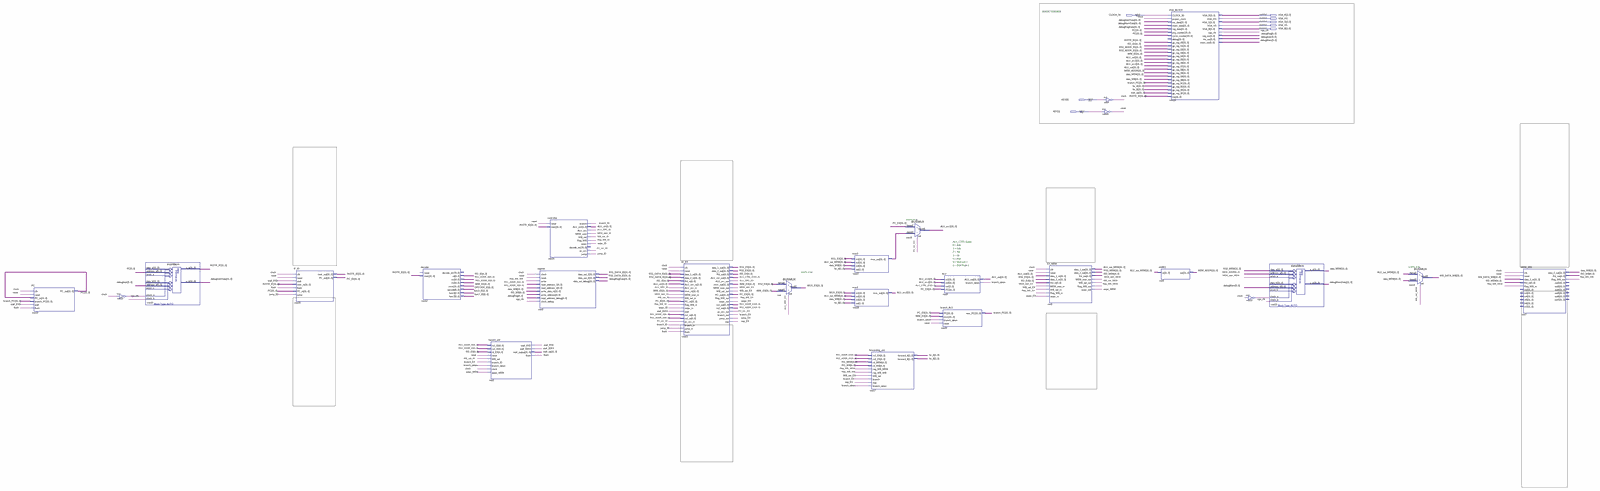
[diagram p0: schematic sheet, whole]
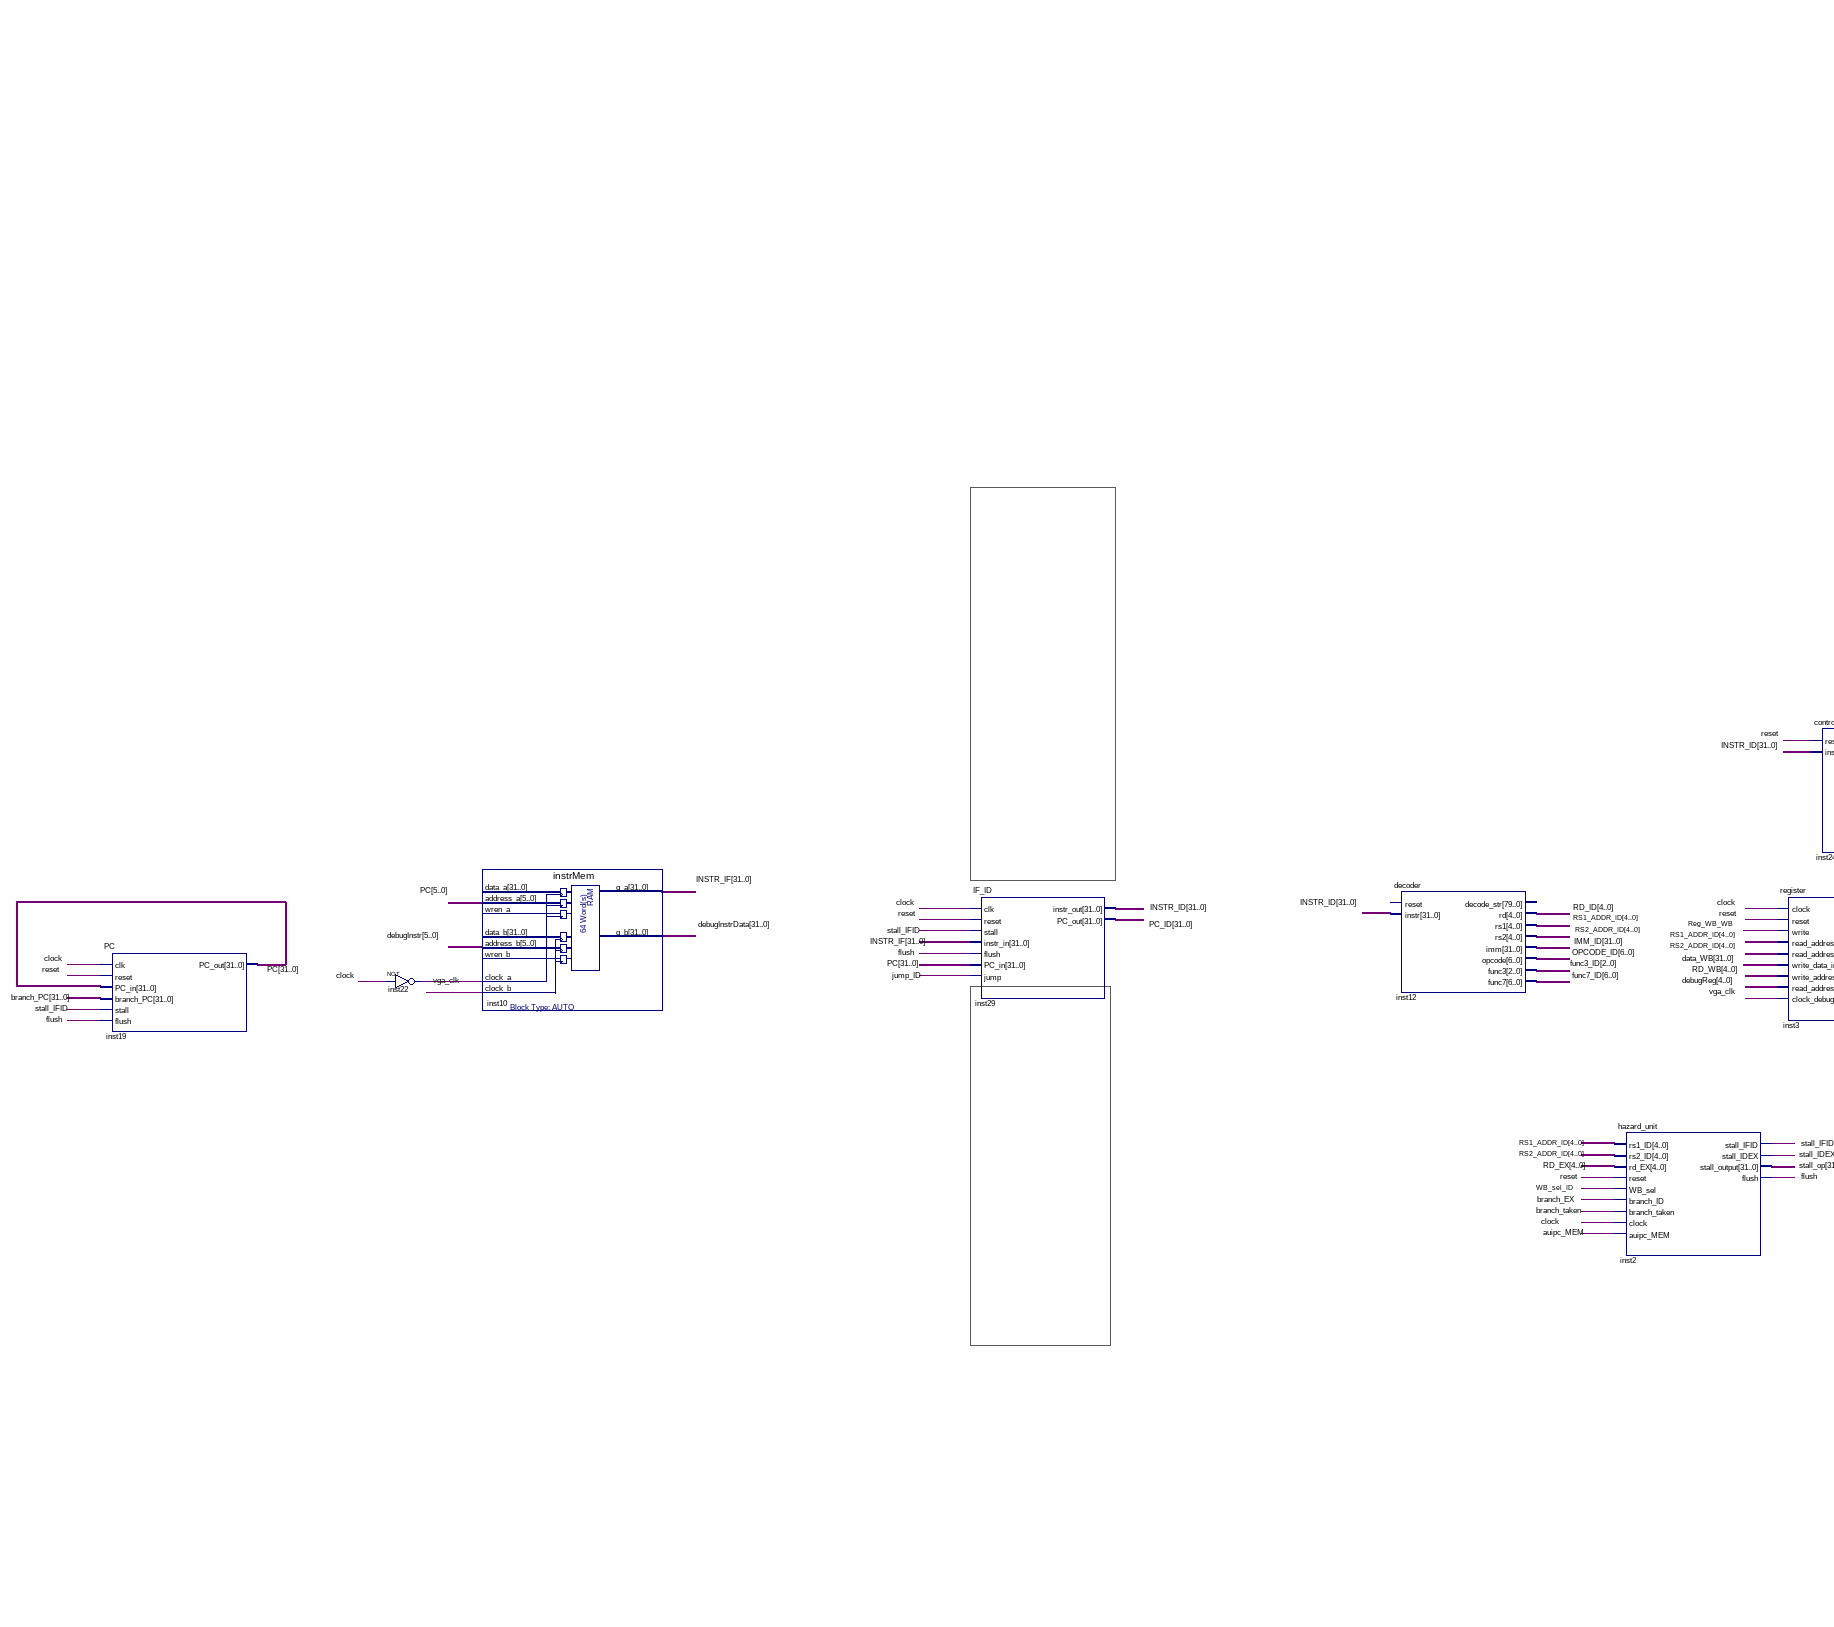
[diagram p1: schematic sheet, left part]
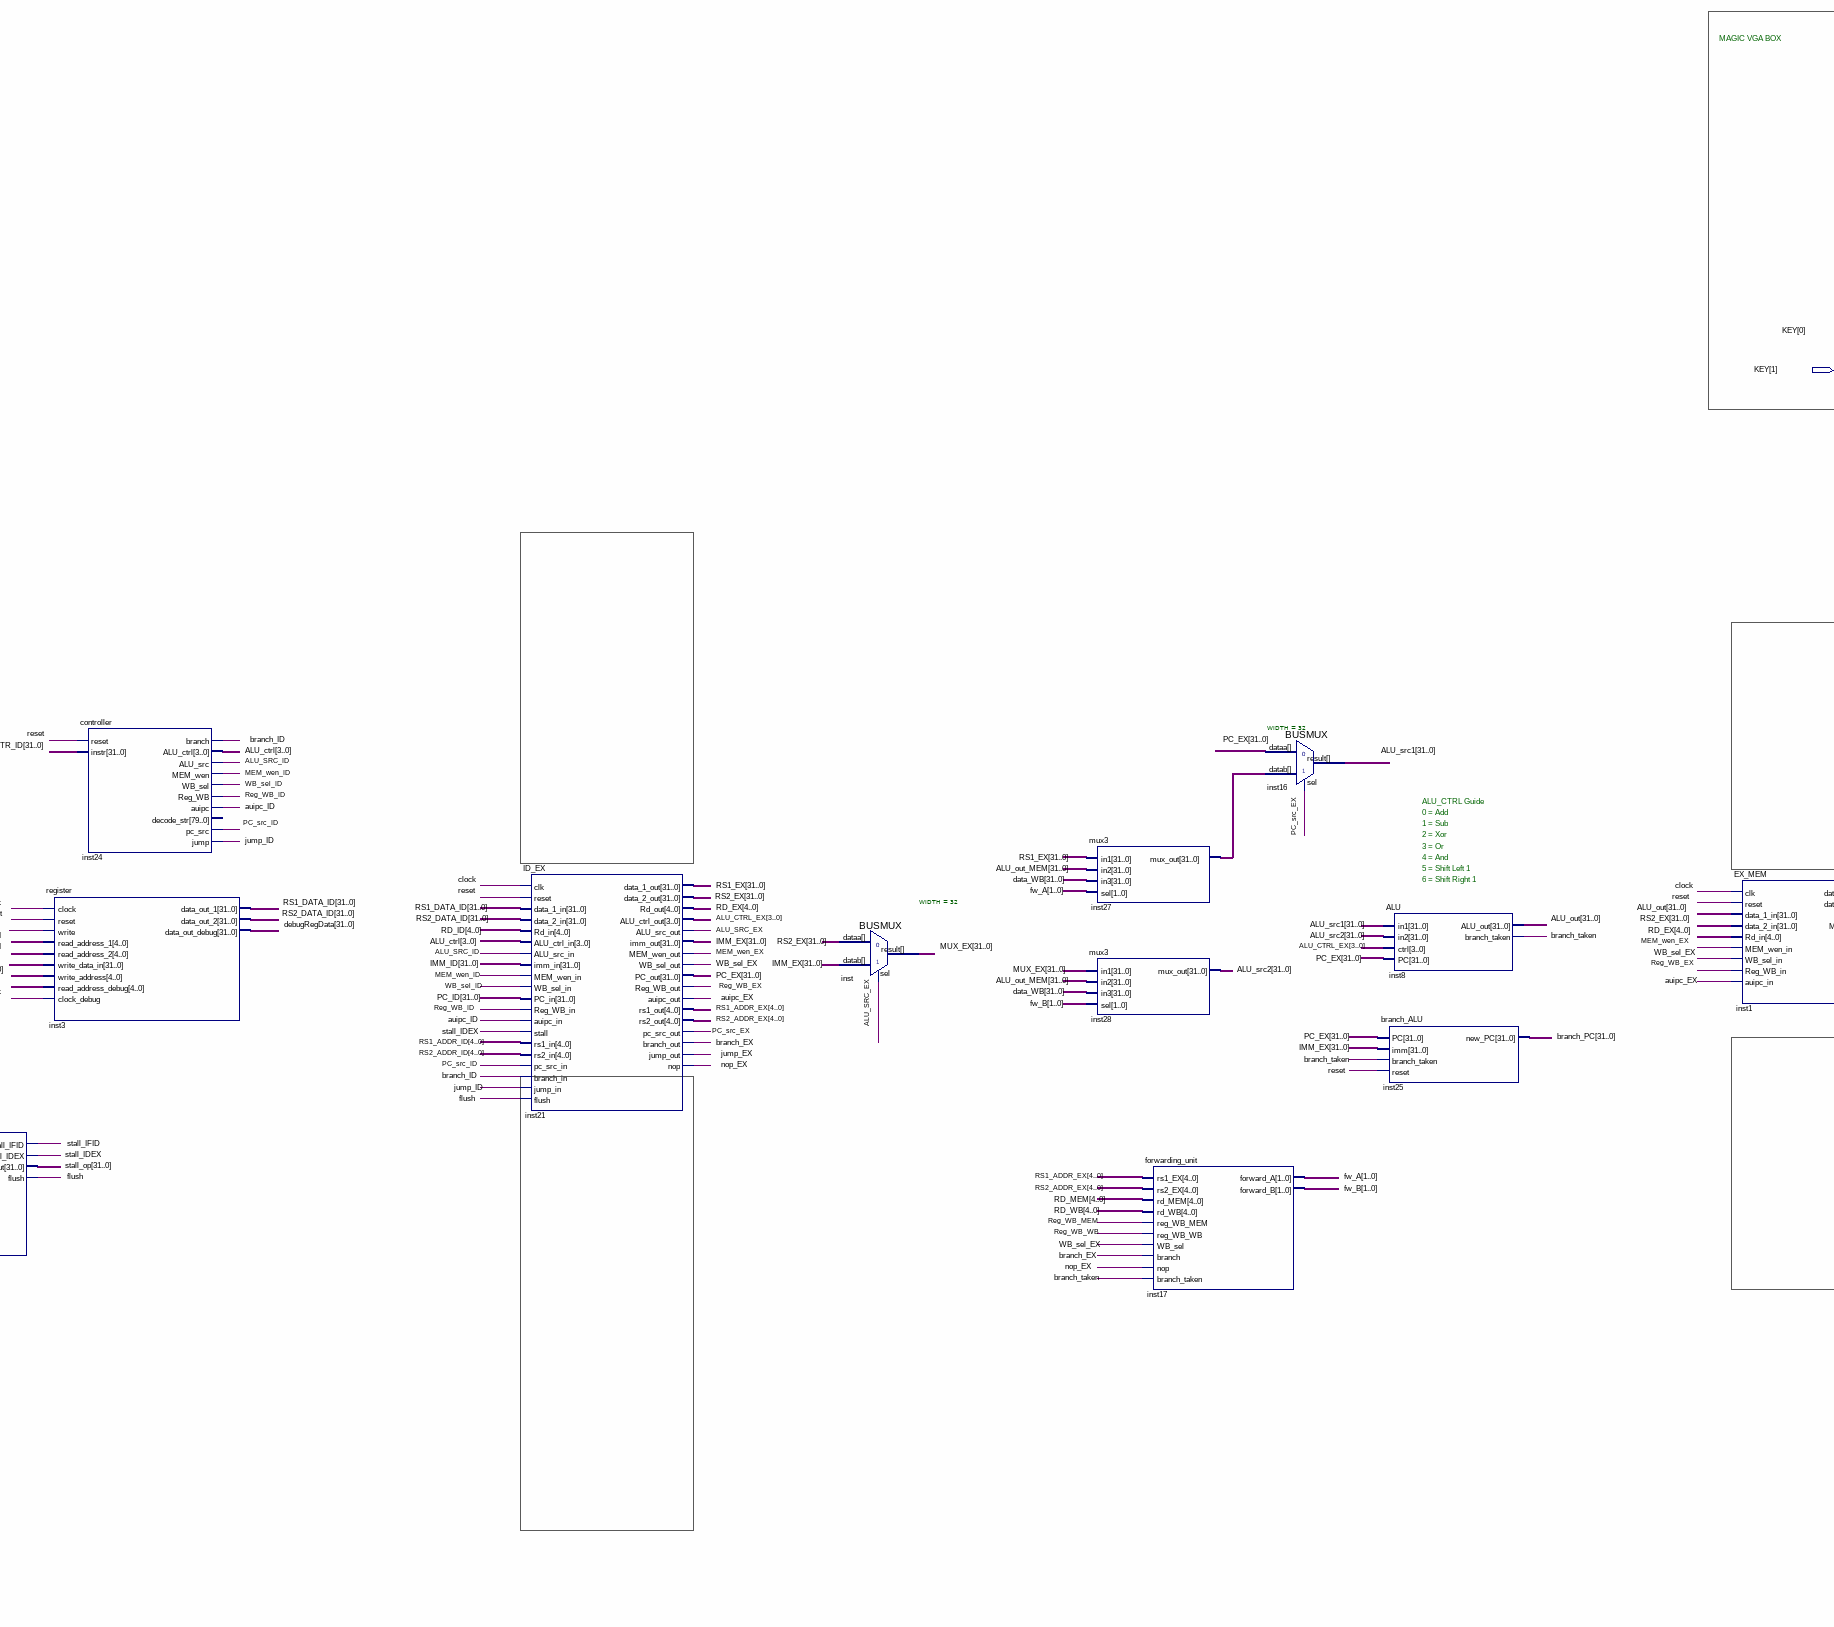
[diagram p2: schematic sheet, centre part]
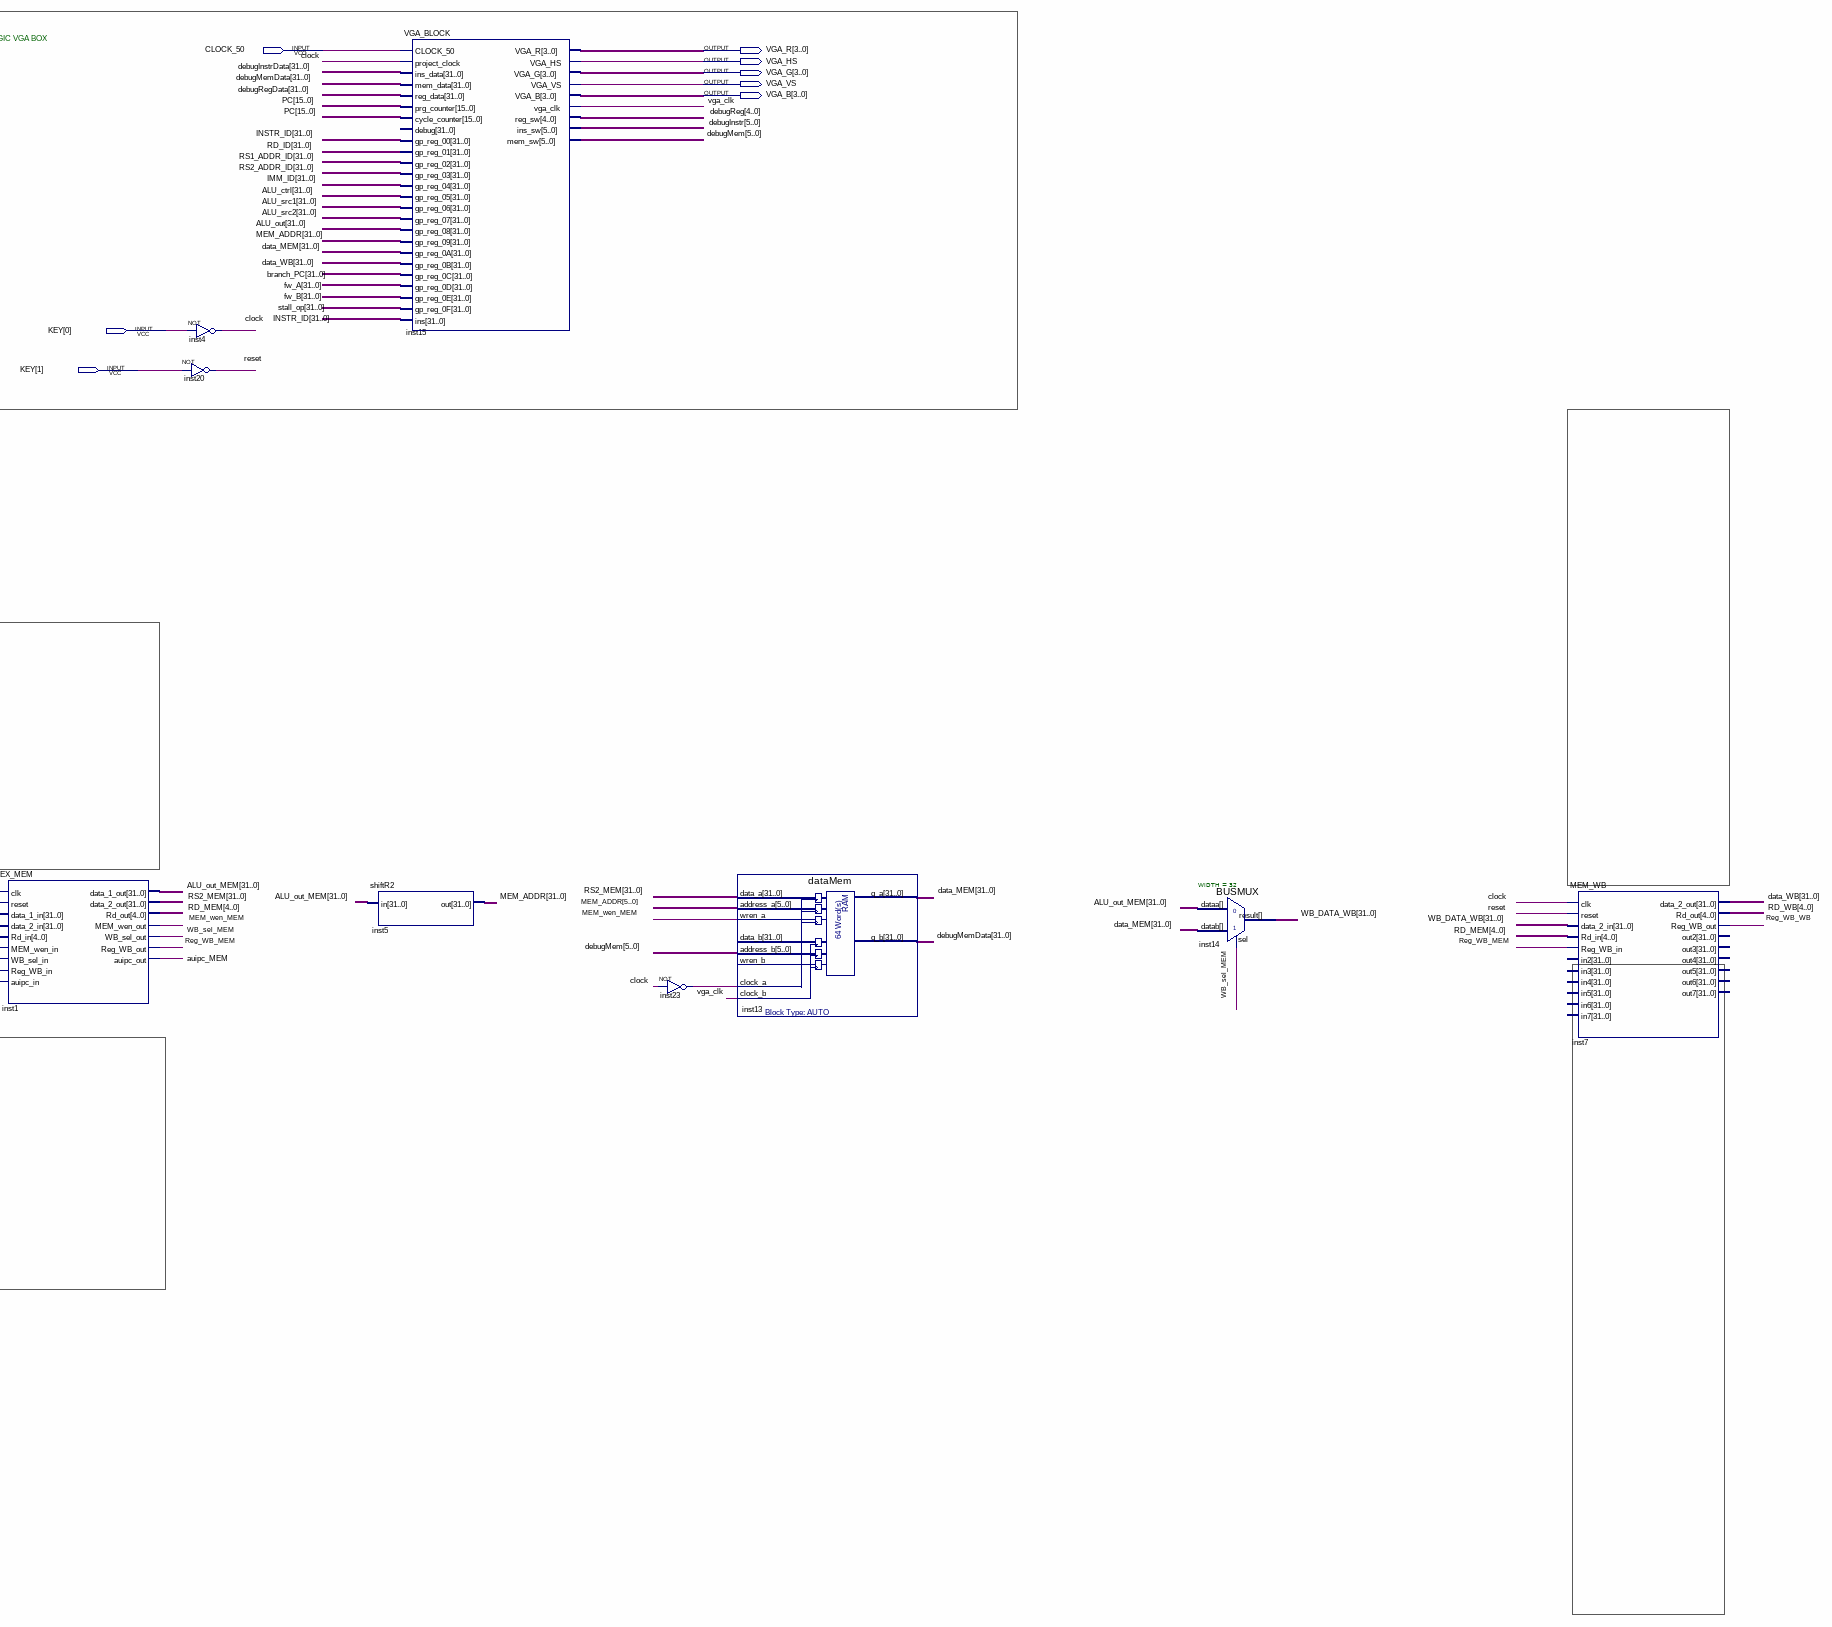
[diagram p3: schematic sheet, right part]
// Quartus schematic top.bdf as structural Verilog: 25 symbols, 8 pins
module top (
  input  CLOCK_50,
  input  [1:0] KEY,
  output [3:0] VGA_R,
  output VGA_HS,
  output [3:0] VGA_G,
  output VGA_VS,
  output [3:0] VGA_B
);

  wire ALU_SRC_EX, ALU_SRC_ID, auipc_EX, auipc_ID, auipc_MEM, branch_EX, branch_ID, branch_taken, clock,
       flush, inst22_out, inst23_out, jump_EX, jump_ID, MEM_wen_EX, MEM_wen_ID, MEM_wen_MEM, nop_EX,
       PC_src_EX, PC_src_ID, Reg_WB_EX, Reg_WB_ID, Reg_WB_MEM, Reg_WB_WB, reset, stall_IDEX, stall_IFID,
       vga_clk, WB_sel_EX, WB_sel_ID, WB_sel_MEM;
  wire [2:0] func3_ID;
  wire [3:0] ALU_CTRL_EX;
  wire [4:0] debugReg, RD_EX, RD_MEM, RD_WB, RS1_ADDR_EX, RS2_ADDR_EX;
  wire [5:0] debugInstr, debugMem;
  wire [6:0] func7_ID, OPCODE_ID;
  wire [31:0] ALU_ctrl, ALU_out, ALU_out_MEM, ALU_src1, ALU_src2, branch_PC, data_MEM, data_WB,
       debugInstrData, debugMemData, debugRegData, fw_A, fw_B, IMM_EX, IMM_ID, inst27_mux_out, INSTR_ID,
       INSTR_IF, MEM_ADDR, MUX_EX, PC, PC_EX, PC_ID, RD_ID, RS1_ADDR_ID, RS1_DATA_ID, RS1_EX, RS2_ADDR_ID,
       RS2_DATA_ID, RS2_EX, RS2_MEM, stall_op, WB_DATA_WB;

  PC inst19 (
    .clk(clock), .reset(reset), .PC_in(PC), .branch_PC(branch_PC), .stall(stall_IFID), .flush(flush),
    .PC_out(PC));
  not inst22 (inst22_out, clock);
  instrMem inst10 (
    .address_a(PC[5:0]), .address_b(debugInstr), .clock_a(inst22_out), .clock_b(vga_clk), .q_a(INSTR_IF),
    .q_b(debugInstrData));  // open: data_a, wren_a, data_b, wren_b
  IF_ID inst29 (
    .clk(clock), .reset(reset), .stall(stall_IFID), .instr_in(INSTR_IF), .flush(flush), .PC_in(PC),
    .jump(jump_ID), .instr_out(INSTR_ID), .PC_out(PC_ID));
  decoder inst12 (
    .instr(INSTR_ID), .rd(RD_ID[4:0]), .rs1(RS1_ADDR_ID[4:0]), .rs2(RS2_ADDR_ID[4:0]), .imm(IMM_ID),
    .opcode(OPCODE_ID), .func3(func3_ID), .func7(func7_ID));  // open: reset, decode_str
  hazard_unit inst2 (
    .rs1_ID(RS1_ADDR_ID[4:0]), .rs2_ID(RS2_ADDR_ID[4:0]), .rd_EX(RD_EX), .reset(reset), .WB_sel(WB_sel_ID),
    .branch_ID(branch_EX), .branch_taken(branch_taken), .clock(clock), .auipc_MEM(auipc_MEM),
    .stall_IFID(stall_IFID), .stall_IDEX(stall_IDEX), .stall_output(stall_op), .flush(flush));
  controller inst24 (
    .reset(reset), .instr(INSTR_ID), .branch(branch_ID), .ALU_ctrl(ALU_ctrl[3:0]), .ALU_src(ALU_SRC_ID),
    .MEM_wen(MEM_wen_ID), .WB_sel(WB_sel_ID), .Reg_WB(Reg_WB_ID), .auipc(auipc_ID), .pc_src(PC_src_ID),
    .jump(jump_ID));  // open: decode_str
  register inst3 (
    .clock(clock), .reset(reset), .write(Reg_WB_WB), .read_address_1(RS1_ADDR_ID[4:0]),
    .read_address_2(RS2_ADDR_ID[4:0]), .write_data_in(data_WB), .write_address(RD_WB),
    .read_address_debug(debugReg), .clock_debug(vga_clk), .data_out_1(RS1_DATA_ID), .data_out_2(RS2_DATA_ID),
    .data_out_debug(debugRegData));
  ID_EX inst21 (
    .clk(clock), .reset(reset), .data_1_in(RS1_DATA_ID), .data_2_in(RS2_DATA_ID), .Rd_in(RD_ID[4:0]),
    .ALU_ctrl_in(ALU_ctrl[3:0]), .ALU_src_in(ALU_SRC_ID), .imm_in(IMM_ID), .MEM_wen_in(MEM_wen_ID),
    .WB_sel_in(WB_sel_ID), .PC_in(PC_ID), .Reg_WB_in(Reg_WB_ID), .auipc_in(auipc_ID), .stall(stall_IDEX),
    .rs1_in(RS1_ADDR_ID[4:0]), .rs2_in(RS2_ADDR_ID[4:0]), .pc_src_in(PC_src_ID), .branch_in(branch_ID),
    .jump_in(jump_ID), .flush(flush), .data_1_out(RS1_EX), .data_2_out(RS2_EX), .Rd_out(RD_EX),
    .ALU_ctrl_out(ALU_CTRL_EX), .ALU_src_out(ALU_SRC_EX), .imm_out(IMM_EX), .MEM_wen_out(MEM_wen_EX),
    .WB_sel_out(WB_sel_EX), .PC_out(PC_EX), .Reg_WB_out(Reg_WB_EX), .auipc_out(auipc_EX),
    .rs1_out(RS1_ADDR_EX), .rs2_out(RS2_ADDR_EX), .pc_src_out(PC_src_EX), .branch_out(branch_EX),
    .jump_out(jump_EX), .nop(nop_EX));
  BUSMUX #(.WIDTH(32)) inst (.datab(IMM_EX), .sel(ALU_SRC_EX), .dataa(RS2_EX), .result(MUX_EX));
  mux3 inst27 (.in1(RS1_EX), .in2(ALU_out_MEM), .in3(data_WB), .sel(fw_A[1:0]), .mux_out(inst27_mux_out));
  mux3 inst28 (.in1(MUX_EX), .in2(ALU_out_MEM), .in3(data_WB), .sel(fw_B[1:0]), .mux_out(ALU_src2));
  forwarding_unit inst17 (
    .rs1_EX(RS1_ADDR_EX), .rs2_EX(RS2_ADDR_EX), .rd_MEM(RD_MEM), .rd_WB(RD_WB), .reg_WB_MEM(Reg_WB_MEM),
    .reg_WB_WB(Reg_WB_WB), .WB_sel(WB_sel_EX), .branch(branch_EX), .nop(nop_EX), .branch_taken(branch_taken),
    .forward_A(fw_A[1:0]), .forward_B(fw_B[1:0]));
  BUSMUX #(.WIDTH(32)) inst16 (.datab(inst27_mux_out), .sel(PC_src_EX), .dataa(PC_EX), .result(ALU_src1));
  ALU inst8 (
    .in1(ALU_src1), .in2(ALU_src2), .ctrl(ALU_CTRL_EX), .PC(PC_EX), .ALU_out(ALU_out),
    .branch_taken(branch_taken));
  branch_ALU inst25 (.PC(PC_EX), .imm(IMM_EX), .branch_taken(branch_taken), .reset(reset), .new_PC(branch_PC));
  EX_MEM inst1 (
    .clk(clock), .reset(reset), .data_1_in(ALU_out), .data_2_in(RS2_EX), .Rd_in(RD_EX),
    .MEM_wen_in(MEM_wen_EX), .WB_sel_in(WB_sel_EX), .Reg_WB_in(Reg_WB_EX), .auipc_in(auipc_EX),
    .data_1_out(ALU_out_MEM), .data_2_out(RS2_MEM), .Rd_out(RD_MEM), .MEM_wen_out(MEM_wen_MEM),
    .WB_sel_out(WB_sel_MEM), .Reg_WB_out(Reg_WB_MEM), .auipc_out(auipc_MEM));
  not inst4 (clock, KEY[0]);
  not inst20 (reset, KEY[1]);
  shiftR2 inst5 (.in(ALU_out_MEM), .out(MEM_ADDR));
  VGA_BLOCK inst15 (
    .CLOCK_50(CLOCK_50), .project_clock(clock), .ins_data(debugInstrData), .mem_data(debugMemData),
    .reg_data(debugRegData), .prg_counter(PC[15:0]), .cycle_counter(PC[15:0]), .gp_reg_00(INSTR_ID),
    .gp_reg_01(RD_ID), .gp_reg_02(RS1_ADDR_ID), .gp_reg_03(RS2_ADDR_ID), .gp_reg_04(IMM_ID),
    .gp_reg_05(ALU_ctrl), .gp_reg_06(ALU_src1), .gp_reg_07(ALU_src2), .gp_reg_08(ALU_out),
    .gp_reg_09(MEM_ADDR), .gp_reg_0A(data_MEM), .gp_reg_0B(data_WB), .gp_reg_0C(branch_PC), .gp_reg_0D(fw_A),
    .gp_reg_0E(fw_B), .gp_reg_0F(stall_op), .ins(INSTR_ID), .VGA_R(VGA_R), .VGA_HS(VGA_HS), .VGA_G(VGA_G),
    .VGA_VS(VGA_VS), .VGA_B(VGA_B), .vga_clk(vga_clk), .reg_sw(debugReg), .ins_sw(debugInstr),
    .mem_sw(debugMem));  // open: debug
  not inst23 (inst23_out, clock);
  dataMem inst13 (
    .data_a(RS2_MEM), .address_a(MEM_ADDR[5:0]), .wren_a(MEM_wen_MEM), .address_b(debugMem),
    .clock_a(inst23_out), .clock_b(vga_clk), .q_a(data_MEM), .q_b(debugMemData));  // open: data_b, wren_b
  BUSMUX #(.WIDTH(32)) inst14 (.datab(data_MEM), .sel(WB_sel_MEM), .dataa(ALU_out_MEM), .result(WB_DATA_WB));
  MEM_WB inst7 (
    .clk(clock), .reset(reset), .data_2_in(WB_DATA_WB), .Rd_in(RD_MEM), .Reg_WB_in(Reg_WB_MEM),
    .data_2_out(data_WB), .Rd_out(RD_WB), .Reg_WB_out(Reg_WB_WB));  // open: in2, in3, in4, in5, in6, in7, out2, out3, out4, out5, out6, out7

  // Notes on the sheet:
  //   MAGIC VGA BOX
  //   ALU_CTRL Guide
  //   0 = Add
  //   1 = Sub
  //   2 = Xor
  //   3 = Or
  //   4 = And
  //   5 = Shift Left 1
  //   6 = Shift Right 1
endmodule
